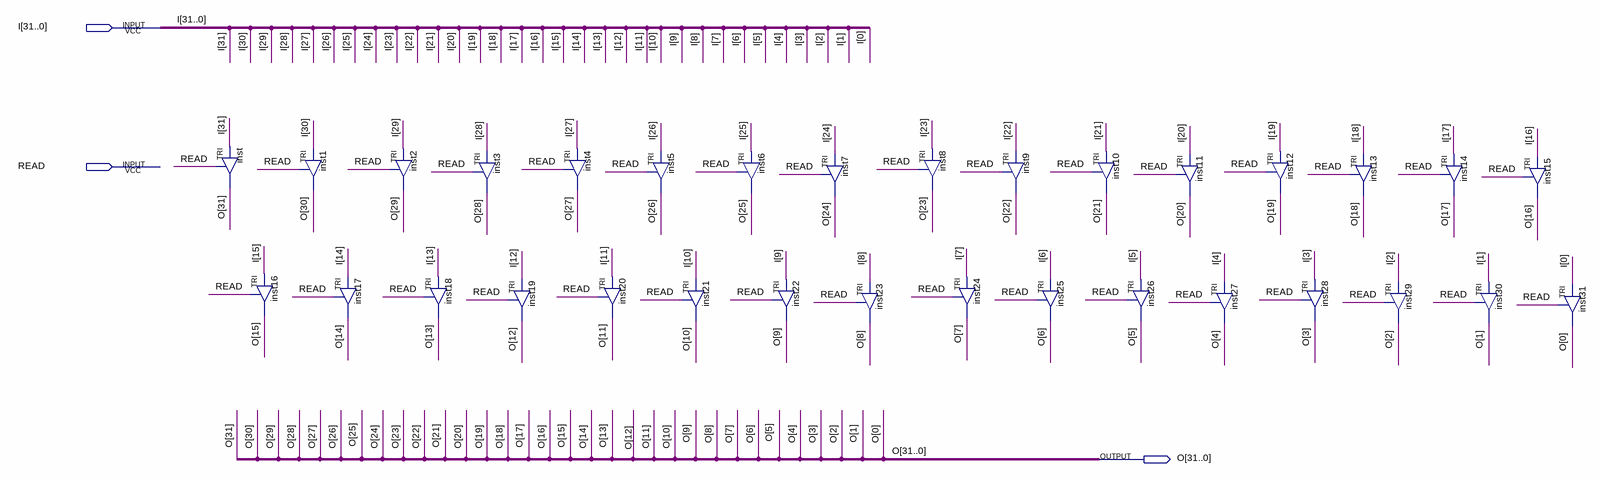
[diagram p0: schematic sheet]
// Quartus schematic Read.bdf as structural Verilog: 32 symbols, 3 pins
module Read (
  input  [31:0] I,
  input  READ,
  output [31:0] O
);

  TRI inst (.IN(I[31]), .OE(READ), .OUT(O[31]));
  TRI inst16 (.IN(I[15]), .OE(READ), .OUT(O[15]));
  TRI inst1 (.IN(I[30]), .OE(READ), .OUT(O[30]));
  TRI inst17 (.IN(I[14]), .OE(READ), .OUT(O[14]));
  TRI inst2 (.IN(I[29]), .OE(READ), .OUT(O[29]));
  TRI inst18 (.IN(I[13]), .OE(READ), .OUT(O[13]));
  TRI inst3 (.IN(I[28]), .OE(READ), .OUT(O[28]));
  TRI inst19 (.IN(I[12]), .OE(READ), .OUT(O[12]));
  TRI inst4 (.IN(I[27]), .OE(READ), .OUT(O[27]));
  TRI inst5 (.IN(I[26]), .OE(READ), .OUT(O[26]));
  TRI inst20 (.IN(I[11]), .OE(READ), .OUT(O[11]));
  TRI inst21 (.IN(I[10]), .OE(READ), .OUT(O[10]));
  TRI inst6 (.IN(I[25]), .OE(READ), .OUT(O[25]));
  TRI inst22 (.IN(I[9]), .OE(READ), .OUT(O[9]));
  TRI inst7 (.IN(I[24]), .OE(READ), .OUT(O[24]));
  TRI inst23 (.IN(I[8]), .OE(READ), .OUT(O[8]));
  TRI inst8 (.IN(I[23]), .OE(READ), .OUT(O[23]));
  TRI inst24 (.IN(I[7]), .OE(READ), .OUT(O[7]));
  TRI inst9 (.IN(I[22]), .OE(READ), .OUT(O[22]));
  TRI inst25 (.IN(I[6]), .OE(READ), .OUT(O[6]));
  TRI inst10 (.IN(I[21]), .OE(READ), .OUT(O[21]));
  TRI inst26 (.IN(I[5]), .OE(READ), .OUT(O[5]));
  TRI inst11 (.IN(I[20]), .OE(READ), .OUT(O[20]));
  TRI inst27 (.IN(I[4]), .OE(READ), .OUT(O[4]));
  TRI inst12 (.IN(I[19]), .OE(READ), .OUT(O[19]));
  TRI inst28 (.IN(I[3]), .OE(READ), .OUT(O[3]));
  TRI inst13 (.IN(I[18]), .OE(READ), .OUT(O[18]));
  TRI inst29 (.IN(I[2]), .OE(READ), .OUT(O[2]));
  TRI inst14 (.IN(I[17]), .OE(READ), .OUT(O[17]));
  TRI inst30 (.IN(I[1]), .OE(READ), .OUT(O[1]));
  TRI inst15 (.IN(I[16]), .OE(READ), .OUT(O[16]));
  TRI inst31 (.IN(I[0]), .OE(READ), .OUT(O[0]));
endmodule
